# EAGLE schematic mux_geurts_3 (EAGLE 6.4)
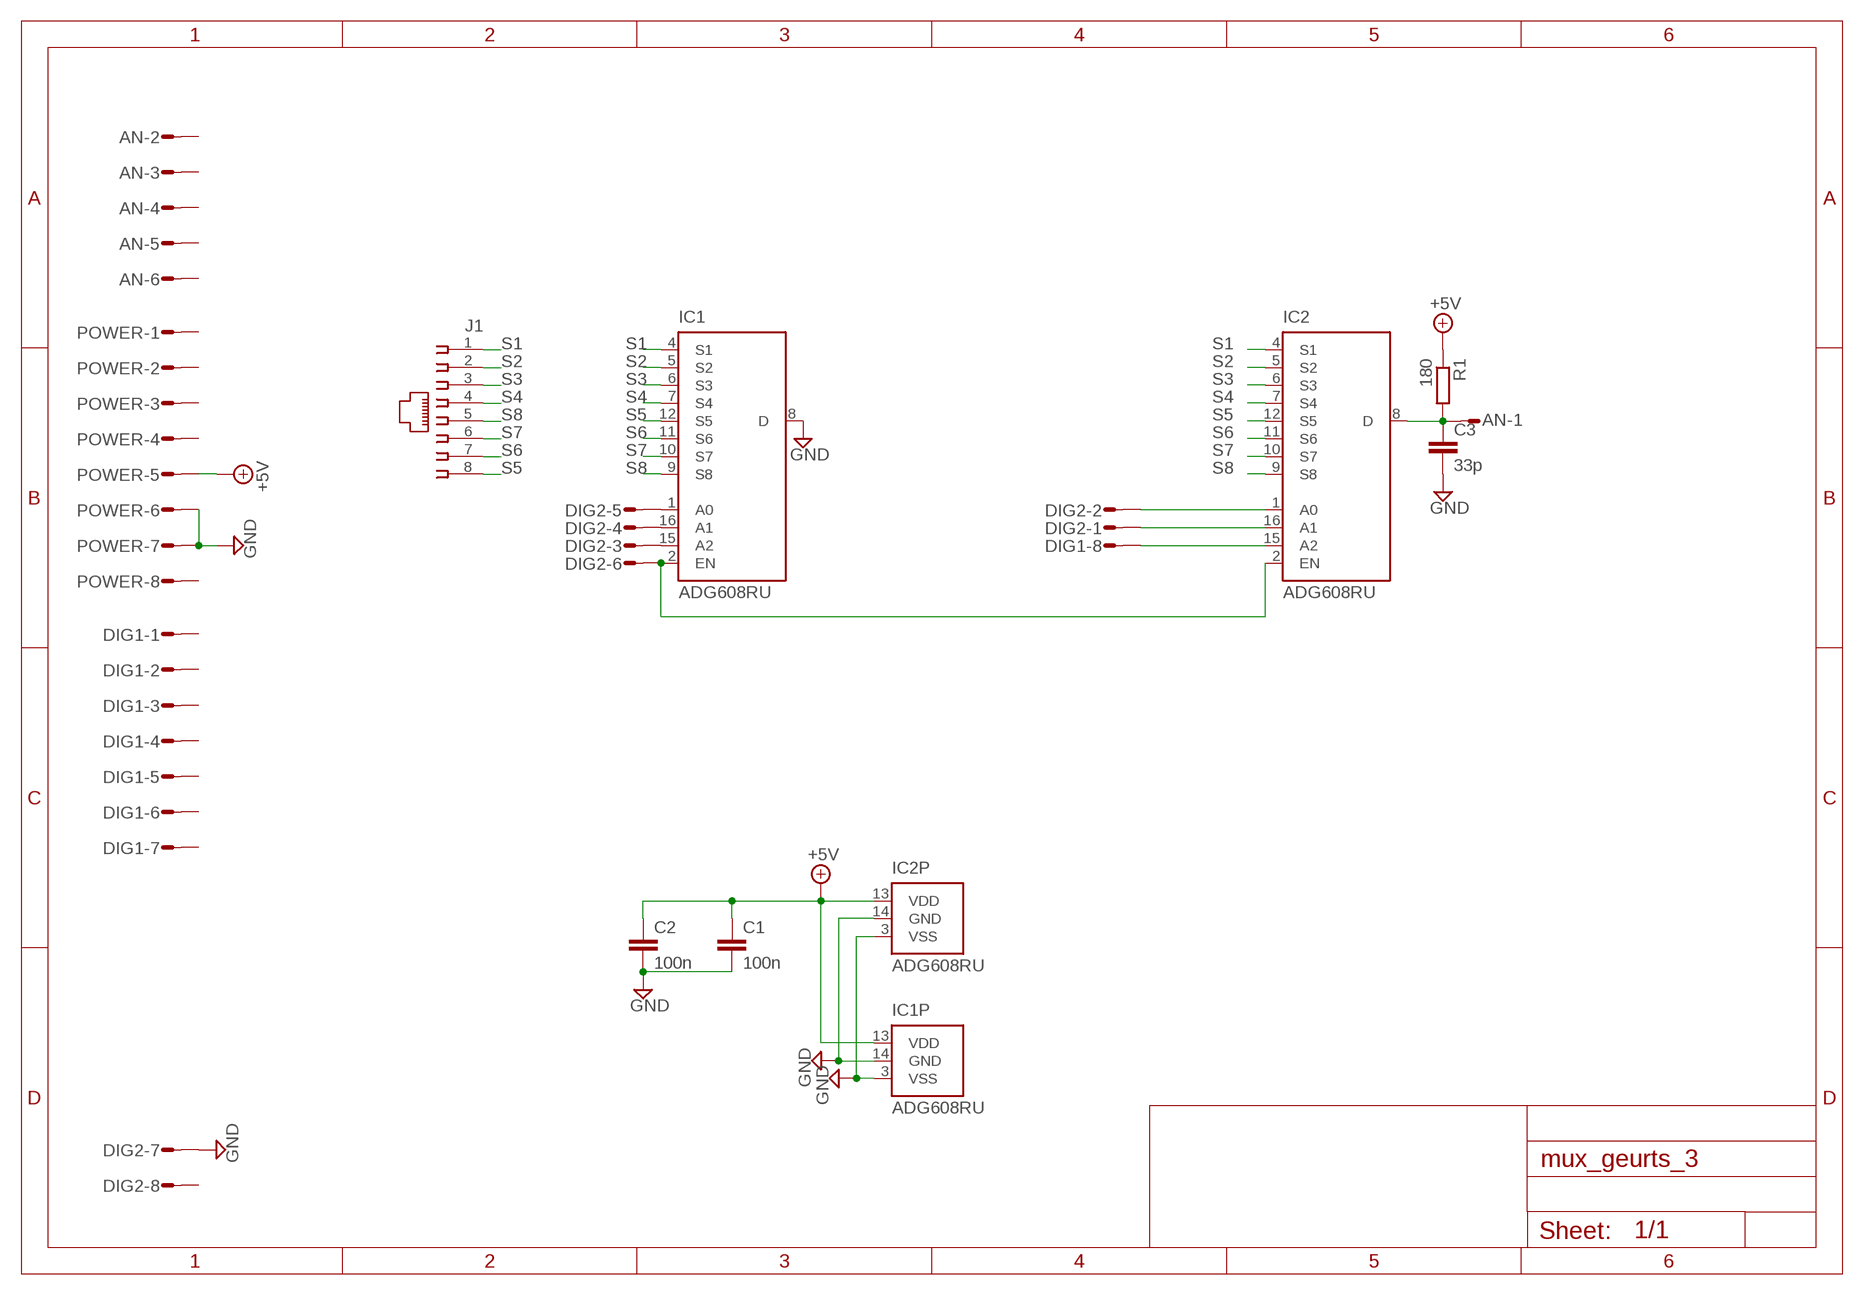
[diagram p0: schematic, sheet 1]

## Parts
AN  M06S  [06P]
C1  100n  C-EUC0805K  [C0805K]
C2  100n  C-EUC0805K  [C0805K]
C3  33p  C-EUC0805K  [C0805K]
DIG1  M08S  [08P]
DIG2  M08S  [08P]
IC1  ADG608RU  [TSSOP16]
IC2  ADG608RU  [TSSOP16]
J1  520251-4  [520251-4]
POWER  M08S  [08P]
R1  180  R-EU_R0805W  [R0805W]

## Nets
+5V: C1.1 C2.1 IC1.13(VDD) IC2.13(VDD) POWER.5 R1.1
GND: C1.2 C2.2 C3.2 DIG2.7 IC1.3(VSS) IC1.8(D) IC1.14(GND) IC2.3(VSS) IC2.14(GND) POWER.6 POWER.7
N$1: DIG2.2 IC2.1(A0)
N$2: DIG2.1 IC2.16(A1)
N$3: DIG1.8 IC2.15(A2)
N$4: DIG2.5 IC1.1(A0)
N$5: DIG2.4 IC1.16(A1)
N$6: DIG2.3 IC1.15(A2)
N$17: AN.1 C3.1 IC2.8(D) R1.2
N$24: DIG2.6 IC1.2(EN) IC2.2(EN)
S1: IC1.4(S1) IC2.4(S1) J1.1
S2: IC1.5(S2) IC2.5(S2) J1.2
S3: IC1.6(S3) IC2.6(S3) J1.3
S4: IC1.7(S4) IC2.7(S4) J1.4
S5: IC1.12(S5) IC2.12(S5) J1.8
S6: IC1.11(S6) IC2.11(S6) J1.7
S7: IC1.10(S7) IC2.10(S7) J1.6
S8: IC1.9(S8) IC2.9(S8) J1.5
Unconnected: AN.2 AN.3 AN.4 AN.5 AN.6 DIG1.1 DIG1.2 DIG1.3 DIG1.4 DIG1.5 DIG1.6 DIG1.7 DIG2.8 POWER.1 POWER.2 POWER.3 POWER.4 POWER.8

## Library data of the parts
AN = con-amp-quick:M06S: AMP QUICK CONNECTOR; OC_FARNELL: unknown; OC_NEWARK: unknown
C1-C3 = rcl:C-EU: CAPACITOR, European symbol
DIG1 DIG2 POWER = con-amp-quick:M08S: AMP QUICK CONNECTOR; OC_FARNELL: unknown; OC_NEWARK: unknown
IC1 IC2 = analog-devices:ADG608: 3 V/5 V, 8 Channel High Performance Analog Multiplexers Source: ADG608_609.pdf; MF: ALTERA CORPORATION; MPN: ADG608BRU; OC_FARNELL: 1465227; OC_NEWARK: 16F6552
J1 = con-amp:520251-4: AMP connector
R1 = rcl:R-EU_: RESISTOR, European symbol